# EAGLE design gateway (EAGLE 4.16)
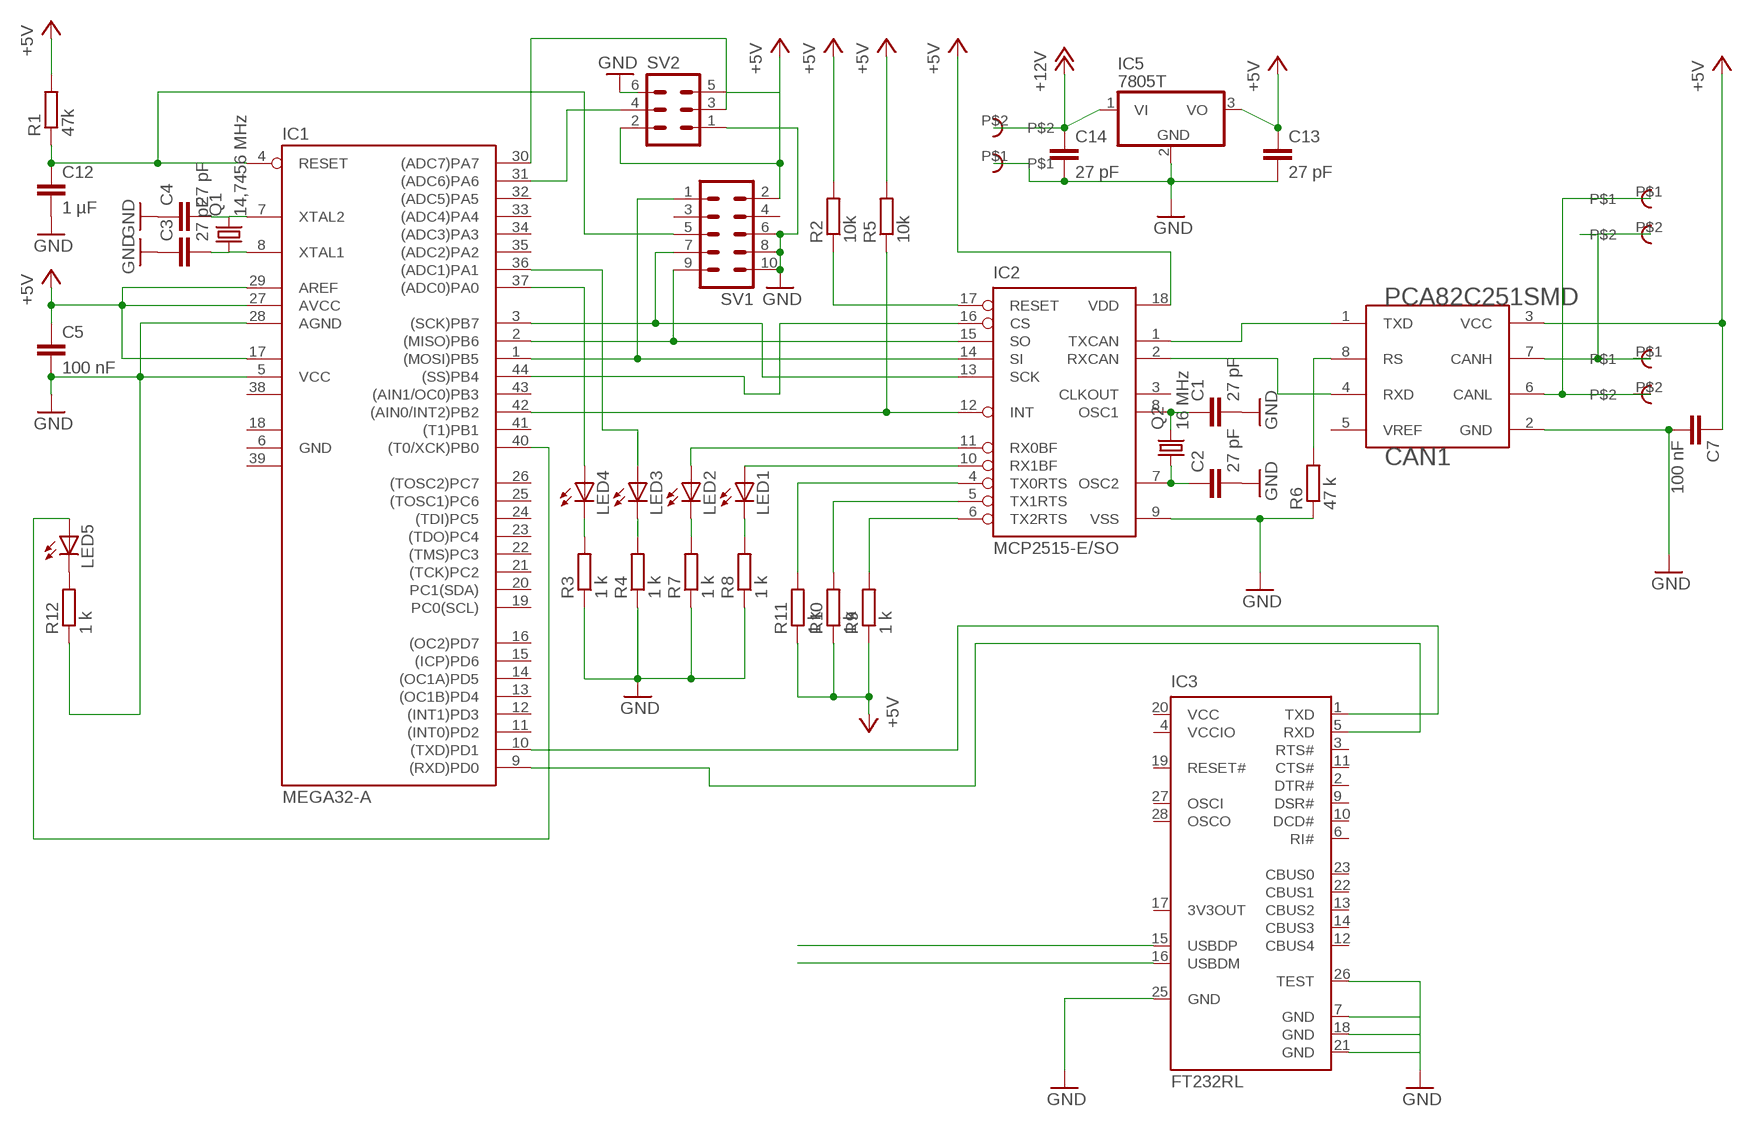
[diagram p0: schematic, sheet 1]

## Parts
C1  27 pF  C-EUC0603K  [C0603K]
C2  27 pF  C-EUC0603K  [C0603K]
C3  27 pF  C-EUC0603K  [C0603K]
C4  27 pF  C-EUC0603K  [C0603K]
C5  100 nF  C-EUC0603K  [C0603K]
C7  100 nF  C-EUC0603K  [C0603K]
C12  1 µF  C-EUC0603K  [C0603K]
C13  27 pF  C-EUC0603K  [C0603K]
C14  27 pF  C-EUC0603K  [C0603K]
CAN1  PCA82C251SMD  [SO8]
IC1  MEGA32-A  [TQFP44]
IC2  MCP2515-E/SO  [SO18L]
IC3  FT232RL  [SSOP28]
IC5  7805T  [TO220H]
LED1  LEDCHIP-LED0603  [CHIP-LED0603]
LED2  LEDCHIP-LED0603  [CHIP-LED0603]
LED3  LEDCHIP-LED0603  [CHIP-LED0603]
LED4  LEDCHIP-LED0603  [CHIP-LED0603]
LED5  LEDCHIP-LED0603  [CHIP-LED0603]
Q1  14,7456 MHz  CRYTALHC49UP  [HC49UP]
Q2  16 MHz  CRYTALHC49UP  [HC49UP]
R1  47k  R-EU_R0603  [R0603]
R2  10k  R-EU_R0603  [R0603]
R3  1 k  R-EU_R0603  [R0603]
R4  1 k  R-EU_R0603  [R0603]
R5  10k  R-EU_R0603  [R0603]
R6  47 k  R-EU_R0603  [R0603]
R7  1 k  R-EU_R0603  [R0603]
R8  1 k  R-EU_R0603  [R0603]
R9  1 k  R-EU_R0603  [R0603]
R10  1 k  R-EU_R0603  [R0603]
R11  1 k  R-EU_R0603  [R0603]
R12  1 k  R-EU_R0603  [R0603]
SV1  ML10  [ML10]
SV2  ML6  [ML6]
U$1  RIACON101-2  [RIACON101-2]
U$2  RIACON101-2  [RIACON101-2]
U$3  RIACON101-2  [RIACON101-2]

## Nets
+5V: C5.1 C7.1 C13.1 CAN1.3(VCC) IC1.17(VCC1) IC1.27(AVCC) IC1.29(AREF) IC2.18(VDD) IC5.3(VO) R1.2 R2.2 R5.2 R9.1 R10.1 R11.1 SV1.2 SV2.2 SV2.5
+12V: C14.1 IC5.1(VI) U$3.P$2
GND: C1.2 C2.2 C3.1 C4.1 C5.2 C7.2 C12.2 C13.2 C14.2 CAN1.2(GND) IC1.5(VCC) IC1.28(AGND) IC2.9(VSS) IC3.7(GND) IC3.18(GND) IC3.21(GND) IC3.25(GND) IC3.26(TEST) IC5.2(GND) R3.1 R4.1 R6.1 R7.1 R8.1 R12.1 SV1.6 SV1.8 SV1.10 SV2.1 SV2.6 U$3.P$1
N$1: IC1.44((SS)PB4) IC2.16(CS)
N$2: IC1.2((MISO)PB6) IC2.15(SO) SV1.9
N$3: IC1.1((MOSI)PB5) IC2.14(SI) SV1.1
N$4: IC1.42((AIN0/INT2)PB2) IC2.12(INT) R5.1
N$5: IC1.3((SCK)PB7) IC2.13(SCK) SV1.7
N$6: CAN1.1(TXD) IC2.1(TXCAN)
N$7: CAN1.4(RXD) IC2.2(RXCAN)
N$8: IC1.10((TXD)PD1) IC3.1(TXD)
N$9: IC1.9((RXD)PD0) IC3.5(RXD)
N$10: C3.2 IC1.8(XTAL1) Q1.1
N$11: C4.2 IC1.7(XTAL2) Q1.2
N$12: C1.1 IC2.8(OSC1) Q2.2
N$13: C2.1 IC2.7(OSC2) Q2.1
N$14: CAN1.8(RS) R6.2
N$16: CAN1.6(CANL) U$1.P$2 U$2.P$1
N$17: CAN1.7(CANH) U$1.P$1 U$2.P$2
N$19: IC3.15(USBDP)
N$20: IC3.16(USBDM)
N$24: LED3.C R4.2
N$25: LED4.C R3.2
N$26: C12.1 IC1.4(RESET) R1.1 SV1.5
N$27: IC2.17(RESET) R2.1
N$28: IC1.37((ADC0)PA0) LED4.A
N$30: LED2.C R7.2
N$31: IC1.36((ADC1)PA1) LED3.A
N$32: LED1.C R8.2
N$33: IC2.10(RX1BF) LED1.A
N$34: IC2.11(RX0BF) LED2.A
N$35: IC2.6(TX2RTS) R9.2
N$36: IC2.5(TX1RTS) R10.2
N$37: IC2.4(TX0RTS) R11.2
N$38: LED5.C R12.2
N$39: IC1.31((ADC6)PA6) SV2.4
N$40: IC1.40((T0/XCK)PB0) LED5.A
N$41: IC1.30((ADC7)PA7) SV2.3
Unconnected: CAN1.5(VREF) IC1.11((INT0)PD2) IC1.12((INT1)PD3) IC1.13((OC1B)PD4) IC1.14((OC1A)PD5) IC1.15((ICP)PD6) IC1.16((OC2)PD7) IC1.19(PC0(SCL)) IC1.20(PC1(SDA)) IC1.21((TCK)PC2) IC1.22((TMS)PC3) IC1.23((TDO)PC4) IC1.24((TDI)PC5) IC1.25((TOSC1)PC6) IC1.26((TOSC2)PC7) IC1.32((ADC5)PA5) IC1.33((ADC4)PA4) IC1.34((ADC3)PA3) IC1.35((ADC2)PA2) IC1.41((T1)PB1) IC1.43((AIN1/OC0)PB3) IC2.3(CLKOUT) IC3.2(DTR#) IC3.3(RTS#) IC3.4(VCCIO) IC3.6(RI#) IC3.9(DSR#) IC3.10(DCD#) IC3.11(CTS#) IC3.12(CBUS4) IC3.13(CBUS2) IC3.14(CBUS3) IC3.17(3V3OUT) IC3.19(RESET#) IC3.20(VCC) IC3.22(CBUS1) IC3.23(CBUS0) IC3.27(OSCI) IC3.28(OSCO) SV1.3 SV1.4

## Power pins joined to a net without a drawn wire
GND: IC1.6(GND)
GND1: IC1.18(GND1)
GND2: IC1.39(GND2)
VCC2: IC1.38(VCC2)

## Library data of the parts
C1-C5 C7 C12-C14 = rcl:C-EU: CAPACITOR, European symbol
CAN1 = 82C250SMD:PCA82C251SMD
IC1 = avr-4:MEGA32: MICROCONTROLLER 32 Kbytes FLASH 2 Kbytes SRAM 1 Kbytes EEPROM USART 8-channel 10 bit ADC
IC2 = mcp2515:MCP2515
IC3 = ftdichip:FT232R: Source: http://www.ftdichip.com/Documents/DataSheets/DS_FT232R_v104.pdf
IC5 = linear:78*: Positive VOLTAGE REGULATOR Source: http://cache.national.com/ds/LM/LM78L05.pdf http://www.fairchildsemi.com/ds/LM/LM7805.pdf
LED1-LED5 = led:LED: LED OSRAM: - CHIPLED LG R971, LG N971, LY N971, LG Q971, LY Q971, LO R971, LY R971 LH N974, LH R974 LS Q976, LO Q976, LY Q976 LO Q996 - Hyper CHIPLED LW Q18S LB Q993, LB Q99A, LB R99A - SideLED LS A670, LO A670, LY A670, LG A670, LP A670 LB A673, LV A673, LT A673, LW A673 LH A674 LY A675 LS A676, LA A676, LO A676, LY A676, LW A676 LS A679, LY A679, LG A679 - Hyper Micro SIDELED® LS Y876, LA Y876, LO Y876, LY Y876 LT Y87S - SmartLED LW L88C, LW L88S LB L89C, LB L89S, LG L890 LS L89K, LO L89K, LY L89K LS L896, LA L896, LO L896, LY L896 - TOPLED LS T670, LO T670, LY T670, LG T670, LP T670 LSG T670, LSP T670, LSY T670, LOP T670, LYG T670 LG T671, LOG T671, LSG T671 LB T673, LV T673, LT T673, LW T673 LH T674 LS T676, LA T676, LO T676, LY T676, LB T676, LH T676, LSB T676, LW T676 LB T67C, LV T67C, LT T67C, LS T67K, LO T67K, LY T67K, LW E67C LS E67B, LA E67B, LO E67B, LY E67B, LB E67C, LV E67C, LT E67C LW T67C LS T679, LY T679, LG T679 LS T770, LO T770, LY T770, LG T770, LP T770 LB T773, LV T773, LT T773, LW T773 LH T774 LS E675, LA E675, LY E675, LS T675 LS T776, LA T776, LO T776, LY T776, LB T776 LHGB T686 LT T68C, LB T68C - Hyper Mini TOPLED® LB M676 - Mini TOPLED Santana® LG M470 LS M47K, LO M47K, LY M47K Source: http://www.osram.convergy.de - LUMILED® LXK2-PW12-R00, LXK2-PW12-S00, LXK2-PW14-U00, LXK2-PW14-V00 LXK2-PM12-R00, LXK2-PM12-S00, LXK2-PM14-U00 LXK2-PE12-Q00, LXK2-PE12-R00, LXK2-PE12-S00, LXK2-PE14-T00, LXK2-PE14-U00 LXK2-PB12-K00, LXK2-PB12-L00, LXK2-PB12-M00, LXK2-PB14-N00, LXK2-PB14-P00, LXK2-PB14-Q00 LXK2-PR12-L00, LXK2-PR12-M00, LXK2-PR14-Q00, LXK2-PR14-R00 LXK2-PD12-Q00, LXK2-PD12-R00, LXK2-PD12-S00 LXK2-PH12-R00, LXK2-PH12-S00 LXK2-PL12-P00, LXK2-PL12-Q00, LXK2-PL12-R00 Source: www.luxeon.com
Q1 Q2 = crystal:CRYTAL: CRYSTAL
R1-R12 = rcl:R-EU_: RESISTOR, European symbol
SV1 = con-harting-ml:ML10: HARTING
SV2 = con-harting-ml:ML6: HARTING
U$1-U$3 = con-riacon101:RIACON101-2: Riaconn Schreaubklemme 101

## Board
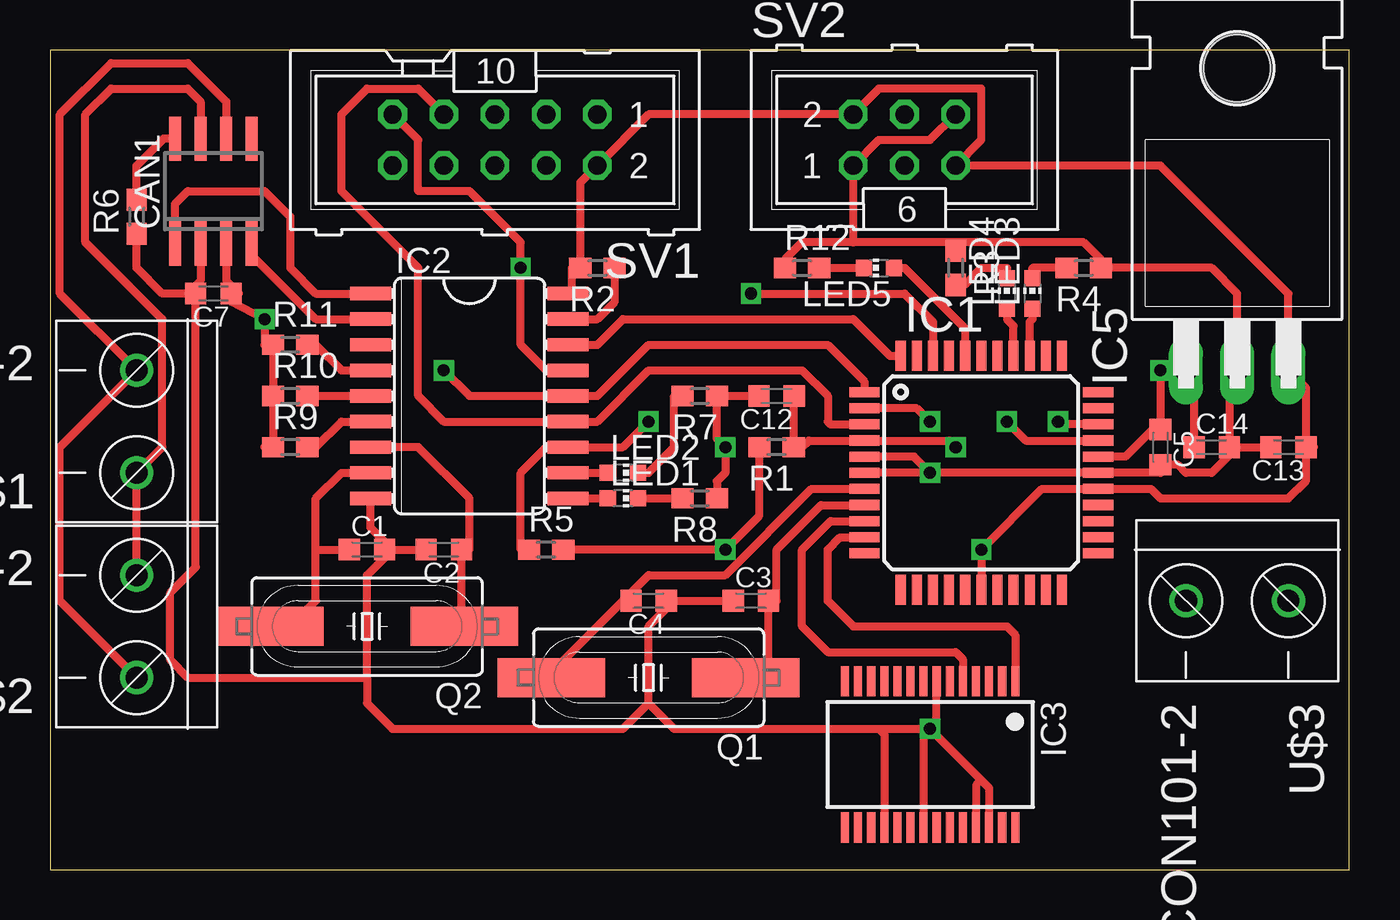
[diagram p1: board, top side]
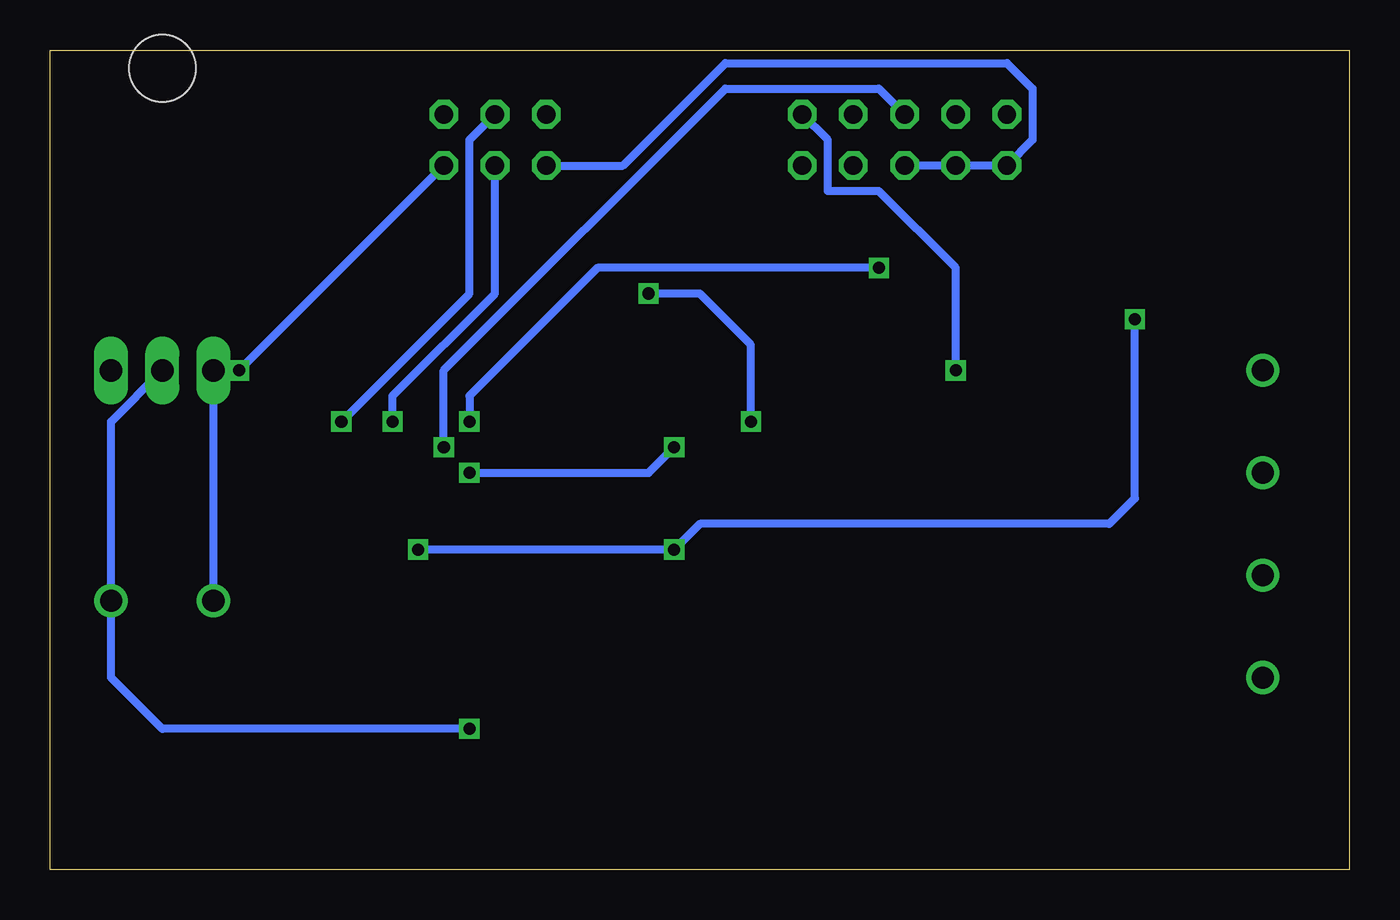
[diagram p2: board, bottom side, seen from below]

Size 64.44 x 40.63 mm. Coordinates in mm from the lower left corner, seen from the top.
Outline: 0,0 64.44,0 64.44,40.63 0,40.63 0,0
Copper layers (1*16): Top 0.035mm / dielectric 1.5mm / Bottom 0.035mm
Design rules "default": minimum track width 10mil, minimum drill 24mil, track to track 8mil, track to pad 8mil, pad to pad 8mil, via to via 8mil, smd to smd 8mil, copper to edge 40mil, drill to drill 8mil, minimum pad ring 10mil, minimum via ring 8mil, stop-mask expansion 4mil, vias tented up to drill 0mil, thermal gap 10mil

### Footprints (pad centres in the part's own frame; a part is rotated, then mirrored left to right if it is on the bottom)
C0603K = smd 1.05 x 1.08: 1 -0.875,0; 2 0.875,0
SO8 = smd 0.6 x 2.2: 1 -1.905,-2.6; 2 -0.635,-2.6; 3 0.635,-2.6; 4 1.905,-2.6; 5 1.905,2.6; 6 0.635,2.6; 7 -0.635,2.6; 8 -1.905,2.6
TQFP44 = smd 1.5 x 0.5: 1 -5.8,4; 2 -5.8,3.2; 3 -5.8,2.4; 4 -5.8,1.6; 5 -5.8,0.8; 6 -5.8,0; 7 -5.8,-0.8; 8 -5.8,-1.6; 9 -5.8,-2.4; 10 -5.8,-3.2; 11 -5.8,-4; 23 5.8,-4; 24 5.8,-3.2; 25 5.8,-2.4; 26 5.8,-1.6; 27 5.8,-0.8; 28 5.8,0; 29 5.8,0.8; 30 5.8,1.6; 31 5.8,2.4; 32 5.8,3.2; 33 5.8,4 | smd 0.5 x 1.5: 12 -4,-5.8; 13 -3.2,-5.8; 14 -2.4,-5.8; 15 -1.6,-5.8; 16 -0.8,-5.8; 17 0,-5.8; 18 0.8,-5.8; 19 1.6,-5.8; 20 2.4,-5.8; 21 3.2,-5.8; 22 4,-5.8; 34 4,5.8; 35 3.2,5.8; 36 2.4,5.8; 37 1.6,5.8; 38 0.8,5.8; 39 0,5.8; 40 -0.8,5.8; 41 -1.6,5.8; 42 -2.4,5.8; 43 -3.2,5.8; 44 -4,5.8
SO18L = smd 0.66 x 2.032: 1 -5.08,-4.902; 2 -3.81,-4.902; 3 -2.54,-4.902; 4 -1.27,-4.902; 5 0,-4.902; 6 1.27,-4.902; 7 2.54,-4.902; 8 3.81,-4.902; 9 5.08,-4.902; 10 5.08,4.902; 11 3.81,4.902; 12 2.54,4.902; 13 1.27,4.902; 14 0,4.902; 15 -1.27,4.902; 16 -2.54,4.902; 17 -3.81,4.902; 18 -5.08,4.902
SSOP28 = smd 0.4 x 1.5: 1 -4.225,-3.625; 2 -3.575,-3.625; 3 -2.925,-3.625; 4 -2.275,-3.625; 5 -1.625,-3.625; 6 -0.975,-3.625; 7 -0.325,-3.625; 8 0.325,-3.625; 9 0.975,-3.625; 10 1.625,-3.625; 11 2.275,-3.625; 12 2.925,-3.625; 13 3.575,-3.625; 14 4.225,-3.625; 15 4.225,3.625; 16 3.575,3.625; 17 2.925,3.625; 18 2.275,3.625; 19 1.625,3.625; 20 0.975,3.625; 21 0.325,3.625; 22 -0.325,3.625; 23 -0.975,3.625; 24 -1.625,3.625; 25 -2.275,3.625; 26 -2.925,3.625; 27 -3.575,3.625; 28 -4.225,3.625
TO220H = drill 1.118 long: 1 -2.54,-10.16; 2 0,-10.16; 3 2.54,-10.16 | hole 3.302: 0,4.826
CHIP-LED0603 = smd 0.8 x 0.8: A 0,-0.75; C 0,0.75
HC49UP = smd 5.334 x 1.93: 1 -4.826,0; 2 4.826,0
R0603 = smd 1.1 x 1: 1 -0.85,0; 2 0.85,0
ML10 = drill 0.914 octagon: 1 -5.08,-1.27; 2 -5.08,1.27; 3 -2.54,-1.27; 4 -2.54,1.27; 5 0,-1.27; 6 0,1.27; 7 2.54,-1.27; 8 2.54,1.27; 9 5.08,-1.27; 10 5.08,1.27
ML6 = drill 0.914 octagon: 1 -2.54,-1.27; 2 -2.54,1.27; 3 0,-1.27; 4 0,1.27; 5 2.54,-1.27; 6 2.54,1.27
RIACON101-2 = drill 1.1 round: P$1 0,2.54; P$2 0,-2.54

### Placement (x,y rotation side)
C1  15.71,15.87 0 top
C2  19.52,15.87 180 top
C3  34.76,13.33 0 top
C4  29.68,13.33 180 top
C5  55.08,20.95 270 top
C7  8.09,28.57 180 top
C12  36.03,23.49 180 top
C13  61.43,20.95 180 top
C14  57.62,20.95 0 top
CAN1  8.09,33.65 0 top
IC1  46.19,19.68 0 top
IC2  20.79,23.49 270 top
IC3  43.65,5.71 180 top
IC5  58.89,34.92 0 top
LED1  28.41,18.41 270 top
LED2  28.41,19.68 270 top
LED3  48.73,28.57 0 top
LED4  47.46,28.57 0 top
LED5  41.11,29.84 90 top
Q1  29.68,9.52 180 top
Q2  15.71,12.06 180 top
R1  36.03,20.95 180 top
R2  27.14,29.84 180 top
R3  44.92,29.84 270 top
R4  51.27,29.84 180 top
R5  24.6,15.87 0 top
R6  4.28,32.38 90 top
R7  32.22,23.49 180 top
R8  32.22,18.41 180 top
R9  11.9,20.95 0 top
R10  11.9,23.49 0 top
R11  11.9,26.03 0 top
R12  37.3,29.84 0 top
SV1  22.06,36.19 180 top
SV2  42.38,36.19 0 top
U$1  4.28,22.22 180 top
U$2  4.28,12.06 180 top
U$3  58.89,13.33 270 top

### Tracks (layer width: path | path; a pad name or v marks a point on that pad's centre or on a via)
+5V  (via drill 0.6)
  Top 0.406: R9.1 10.63,20.95 11.05,21.37 R10.1 11.05,25.61 10.63,26.03 | 55.08,22.22 C5.1 | C13.1 62.31,23.88 IC5.3 61.43,28.57 55.08,34.92 SV2.5 46.19,36.19 46.19,38.73 41.11,38.73 SV2.2 29.68,37.46 SV1.2 26.29,34.07 R2.2 25.87,29.84 25.87,28.57 IC2.18 | C13.1 62.7,20.95 | R1.2 35.18,17.56 v33.49,15.87 R5.2 | 10.63,26.03 v10.63,27.3 8.96,28.17 C7.1 9.36,28.57 8.73,29.2 CAN1.3 | C13.1 62.31,19.28 61.43,18.41 55.08,18.41 54.61,18.88 IC1.27 49.2,18.88 v46.19,15.87 IC1.17 | 10.63,26.03 R11.1 | IC1.29 53.34,20.48 55.08,22.22 | v55.08,24.76 55.08,22.22
  Bottom 0.406: v46.19,15.87 v33.49,15.87 32.22,17.14 11.9,17.14 10.63,18.41 v10.63,27.3 | SV2.5 v55.08,24.76
+12V
  Top 0.406: C14.1 56.75,24.36 IC5.1
  Bottom 0.406: U$3.P$2 IC5.1
GND  (via drill 0.6)
  Top 0.406: IC2.9 15.89,16.96 16.98,15.87 | 16.98,15.87 C1.2 | C3.1 C4.1 30.56,12.93 29.68,12.06 29.68,8.25 | IC1.5 42.85,20.48 v43.65,19.68 | v43.65,19.68 IC1.28 55.08,19.68 C5.2 55.95,20.07 56.35,19.68 57.62,19.68 58.5,20.55 C14.2 | v43.65,19.68 IC1.6 | C14.2 C13.2 | C14.2 58.5,24.36 IC5.2 58.89,28.57 57.62,29.84 R4.1 52.12,30.26 51.27,31.11 44.92,31.11 | C12.2 R7.1 33.07,21.37 v33.49,20.95 33.49,19.68 33.07,19.26 R8.1 | 16.98,15.87 C2.2 | 16.98,15.87 15.71,14.6 15.71,9.52 | 15.71,9.52 15.71,8.25 16.98,6.98 28.41,6.98 29.68,8.25 | 15.71,9.52 6.82,9.52 5.95,10.39 5.95,13.72 7.21,14.99 C7.2 6.82,28.57 | 29.68,8.25 30.95,6.98 41.11,6.98 | IC3.7 43.98,7.3 v43.65,6.98 | 41.11,6.98 v43.65,6.98 | IC3.26 46.58,4.05 46.19,4.44 | v43.65,6.98 46.19,4.44 | IC3.25 45.93,4.17 46.19,4.44 | IC3.21 43.33,6.65 v43.65,6.98 | IC3.18 41.38,6.71 41.11,6.98 | 44.92,31.11 39.84,31.11 | SV2.6 43.65,36.19 41.11,36.19 SV2.1 39.84,31.11 | 39.84,31.11 37.3,31.11 36.45,30.26 R12.1 | 44.92,31.11 R3.1 | 6.82,28.57 5.55,28.57 4.28,29.84 R6.1 | CAN1.2 7.46,29.2 6.82,28.57
  Bottom 0.406: IC5.2 61.43,22.22 U$3.P$1 61.43,9.52 58.89,6.98 v43.65,6.98 | SV2.1 36.03,34.92 30.95,40 16.98,40 15.71,38.73 15.71,36.19 SV1.10 | v43.65,19.68 34.76,19.68 v33.49,20.95 | SV1.8 SV1.6 | SV1.10 SV1.8 | SV1.10 SV1.8
N$1
  Top 0.406: IC1.44 41.66,25.48 39.84,27.3 28.41,27.3 27.14,26.03 IC2.16
N$2  (via drill 0.6)
  Top 0.406: IC2.15 24.6,24.76 23.33,26.03 v23.33,29.84 23.33,31.11 20.79,33.65 18.25,33.65 18.25,36.19 SV1.9 | IC1.2 42.99,22.88 v43.65,22.22
  Bottom 0.406: v43.65,22.22 43.65,23.49 37.3,29.84 v23.33,29.84
N$3  (via drill 0.6)
  Top 0.406: IC1.1 40.39,24.21 38.57,26.03 29.68,26.03 27.14,23.49 IC2.14 20.79,23.49 v19.52,24.76
  Bottom 0.406: v19.52,24.76 19.52,29.84 23.33,33.65 25.87,33.65 25.87,36.19 SV1.1
N$4  (via drill 0.6)
  Top 0.406: R5.1 23.33,15.87 23.33,19.68 24.6,20.95 IC2.12 28.41,20.95 v29.68,22.22 | IC1.42 43.79,27.16 42.38,28.57 v34.76,28.57
  Bottom 0.406: v34.76,28.57 32.22,28.57 29.68,26.03 v29.68,22.22
N$5
  Top 0.406: 25.87,22.22 27.14,22.22 29.68,24.76 37.3,24.76 38.57,23.49 38.57,22.22 38.71,22.08 IC1.3 | SV1.7 18.25,38.73 15.71,38.73 14.44,37.46 14.44,33.65 18.25,29.84 18.25,23.49 19.52,22.22 25.87,22.22 | 25.87,22.22 IC2.13
N$6
  Top 0.406: IC2.1 13.17,28.57 11.9,29.84 11.9,32.38 10.63,33.65 6.82,33.65 6.18,33.02 CAN1.1
N$7
  Top 0.406: IC2.2 13.17,27.3 10,30.47 CAN1.4
N$8
  Top 0.406: IC3.1 47.88,11.64 47.46,12.06 39.84,12.06 38.57,13.33 38.57,15.87 39.18,16.48 IC1.10
N$9
  Top 0.406: IC1.9 38.71,17.28 37.3,15.87 37.3,12.06 38.57,10.79 44.92,10.79 45.28,10.43 IC3.5
N$10
  Top 0.406: Q1.1 36.03,9.52 35.64,9.91 C3.2 36.03,13.33 36.03,15.87 38.24,18.08 IC1.8
N$11
  Top 0.406: Q1.2 24.6,9.52 28.41,13.33 | IC1.7 37.77,18.88 33.49,14.6 29.68,14.6 28.41,13.33 | 28.41,13.33 C4.2
N$12
  Top 0.406: IC2.8 14.44,19.68 13.17,18.41 13.17,15.87 | 13.17,15.87 13.17,13.33 11.9,12.06 Q2.2 9.36,12.06 | 13.17,15.87 C1.1
N$13
  Top 0.406: IC2.7 18.25,20.95 20.79,18.41 20.79,15.87 C2.1 20.39,12.93 19.52,12.06 Q2.1
N$14
  Top 0.406: R6.2 4.28,34.92 5.61,36.25 CAN1.8
N$16
  Top 0.406: CAN1.6 8.73,38.09 6.82,40 3.01,40 0.47,37.46 0.47,28.57 U$1.P$2 0.47,20.95 0.47,13.33 U$2.P$1
N$17
  Top 0.406: CAN1.7 7.46,38.09 6.82,38.73 3.01,38.73 1.74,37.46 1.74,31.11 5.55,27.3 5.55,20.95 U$1.P$1 U$2.P$2
N$24
  Top 0.406: LED3.C 48.73,29.84 R4.2
N$25
  Top 0.406: R3.2 45.34,28.99 46.19,29.84 47.46,29.84 LED4.C
N$26  (via drill 0.6)
  Top 0.406: 37.3,20.95 37.63,21.28 IC1.4 44.59,21.28 v44.92,20.95 | R1.1 37.3,20.95 | C12.1 36.91,21.34 37.3,20.95
  Bottom 0.406: v44.92,20.95 44.92,24.76 30.95,38.73 23.33,38.73 SV1.5
N$27
  Top 0.406: IC2.17 27.14,27.3 27.99,28.15 R2.1
N$28
  Top 0.406: IC1.37 47.79,26.97 47.46,27.3 LED4.A
N$30
  Top 0.406: LED2.C 29.68,19.68 30.95,20.95 30.95,23.49 R7.2
N$31
  Top 0.406: IC1.36 48.59,27.16 48.73,27.3 LED3.A
N$32
  Top 0.406: LED1.C R8.2
N$33
  Top 0.406: IC2.10 LED1.A
N$34
  Top 0.406: IC2.11 LED2.A
N$35
  Top 0.406: R9.2 13.17,20.95 14.44,22.22 IC2.6
N$36
  Top 0.406: R10.2 IC2.5
N$37
  Top 0.406: R11.2 13.17,26.03 14.44,24.76 IC2.4
N$38
  Top 0.406: R12.2 LED5.C
N$39  (via drill 0.6)
  Top 0.406: IC1.31 50.14,22.08 v50,22.22
  Bottom 0.406: SV2.4 43.65,36.19 43.65,28.57 v50,22.22
N$40
  Top 0.406: IC1.40 45.39,26.83 42.38,29.84 LED5.A
N$41  (via drill 0.6)
  Top 0.406: IC1.30 48.4,21.28 v47.46,22.22
  Bottom 0.406: SV2.3 42.38,28.57 47.46,23.49 v47.46,22.22